# EAGLE design RGBNDR (EAGLE 9.0.0)
CNAME: otsos.net; CREVISION: 3; DESIGNER: Otso Sorvettula
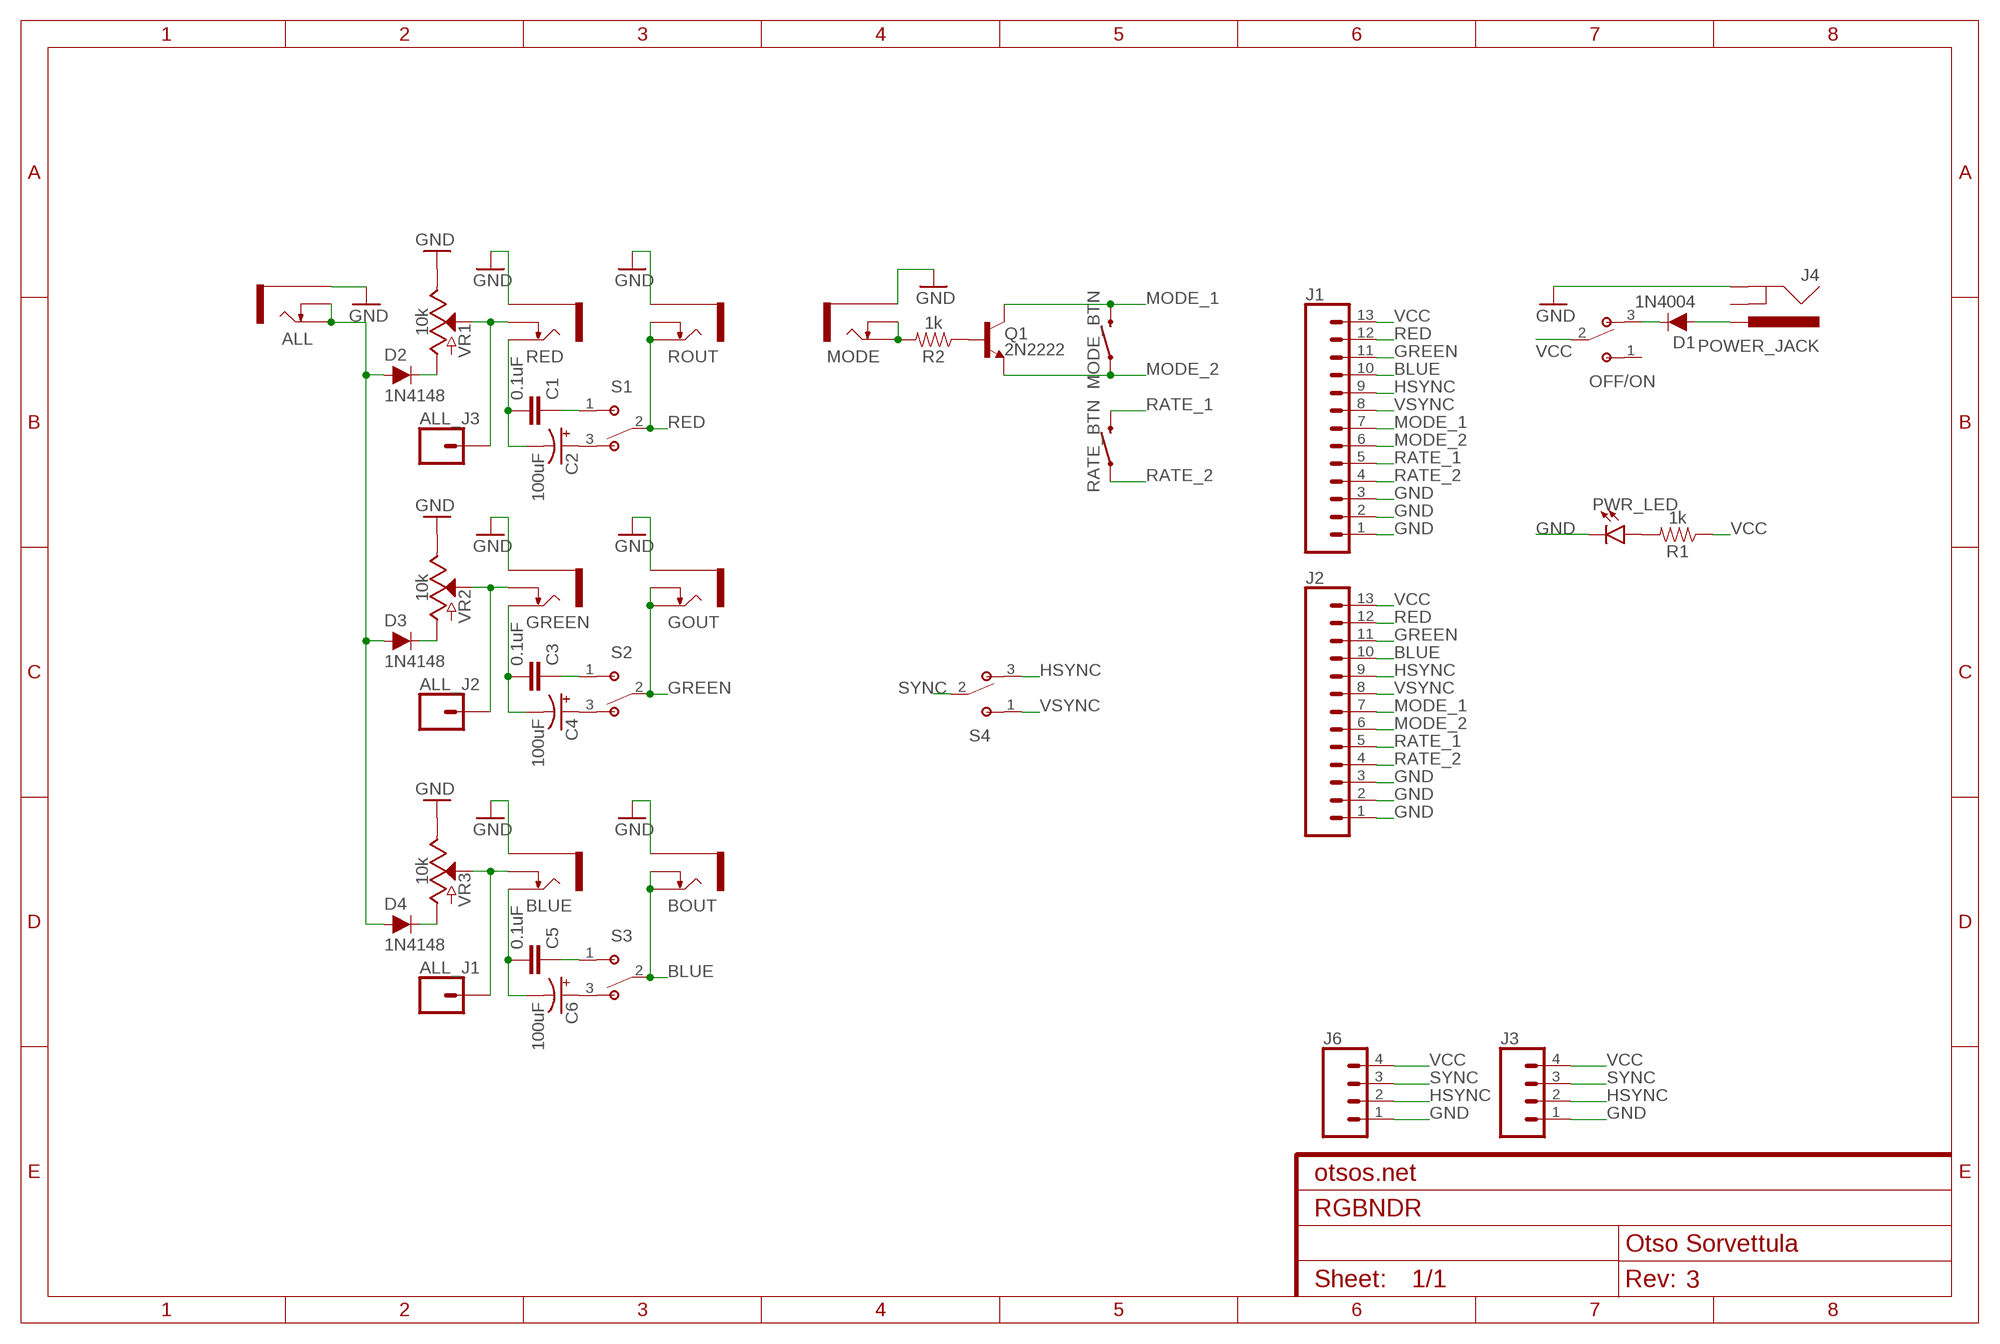
[diagram p0: schematic, sheet 1]

## Parts
ALL  THONKICONNNEW  [WQP-PJ301M-12_JACK]
ALL_J1  CONN_01PTH_NO_SILK_YES_STOP  [1X01_NO_SILK]
ALL_J2  CONN_01PTH_NO_SILK_YES_STOP  [1X01_NO_SILK]
ALL_J3  CONN_01PTH_NO_SILK_YES_STOP  [1X01_NO_SILK]
BLUE  THONKICONNNEW  [WQP-PJ301M-12_JACK]
BOUT  THONKICONNNEW  [WQP-PJ301M-12_JACK]
C1  0.1uF  C-EU025-025X050  [C025-025X050]
C2  100uF  100UF-POLAR-RADIAL-2.5MM-25V-20%  [CPOL-RADIAL-2.5MM-6.5MM]
C3  0.1uF  C-EU025-025X050  [C025-025X050]
C4  100uF  100UF-POLAR-RADIAL-2.5MM-25V-20%  [CPOL-RADIAL-2.5MM-6.5MM]
C5  0.1uF  C-EU025-025X050  [C025-025X050]
C6  100uF  100UF-POLAR-RADIAL-2.5MM-25V-20%  [CPOL-RADIAL-2.5MM-6.5MM]
D1  1N4004  DIODE-PTH  [DIODE-1N4001]
D2  1N4148  DIODE-1N4148  [DIODE-1N4148]
D3  1N4148  DIODE-1N4148  [DIODE-1N4148]
D4  1N4148  DIODE-1N4148  [DIODE-1N4148]
GOUT  THONKICONNNEW  [WQP-PJ301M-12_JACK]
GREEN  THONKICONNNEW  [WQP-PJ301M-12_JACK]
J1  CONN_13LONGPADS  [1X13-LONGPADS]
J2  CONN_13LONGPADS  [1X13-LONGPADS]
J3  CONN_04  [1X04]
J4  POWER_JACK  [POWER_JACK_PTH]
J6  CONN_04  [1X04]
MODE  THONKICONNNEW  [WQP-PJ301M-12_JACK]
MODE_BTN  MOMENTARY-SWITCH-SPST-PTH-6.0MM  [TACTILE_SWITCH_PTH_6.0MM]
OFF/ON  OS102011MS2QN1  [SW_OS102011MS2QN1]
PWR_LED  LED3MM  [LED_3MM]
Q1  2N2222  TRANS_NPN-2N3904  [TO-92]
R1  1k  1KOHM-HORIZ-1/4W-1%  [AXIAL-0.3]
R2  1k  1KOHM-HORIZ-1/4W-1%  [AXIAL-0.3]
RATE_BTN  MOMENTARY-SWITCH-SPST-PTH-6.0MM  [TACTILE_SWITCH_PTH_6.0MM]
RED  THONKICONNNEW  [WQP-PJ301M-12_JACK]
ROUT  THONKICONNNEW  [WQP-PJ301M-12_JACK]
S1  OS102011MS2QN1  [SW_OS102011MS2QN1]
S2  OS102011MS2QN1  [SW_OS102011MS2QN1]
S3  OS102011MS2QN1  [SW_OS102011MS2QN1]
S4  OS102011MS2QN1  [SW_OS102011MS2QN1]
VR1  10k  POTENTIOMETER-PTH-9MM-1/20W-20%  [POT-PTH-ALPS]
VR2  10k  POTENTIOMETER-PTH-9MM-1/20W-20%  [POT-PTH-ALPS]
VR3  10k  POTENTIOMETER-PTH-9MM-1/20W-20%  [POT-PTH-ALPS]

## Nets
BLUE: BOUT.P$1_TIP(TIP) BOUT.P$2_SWITCH(SWITCH) J1.10 J2.10 S3.2
GND: ALL.P$3_SLEEVE(SLEEVE) BLUE.P$3_SLEEVE(SLEEVE) BOUT.P$3_SLEEVE(SLEEVE) GOUT.P$3_SLEEVE(SLEEVE) GREEN.P$3_SLEEVE(SLEEVE) J1.1 J1.2 J1.3 J2.1 J2.2 J2.3 J3.1 J4.GND J6.1 MODE.P$3_SLEEVE(SLEEVE) PWR_LED.K(C) RED.P$3_SLEEVE(SLEEVE) ROUT.P$3_SLEEVE(SLEEVE) VR1.P$1(E) VR2.P$1(E) VR3.P$1(E)
GREEN: GOUT.P$1_TIP(TIP) GOUT.P$2_SWITCH(SWITCH) J1.11 J2.11 S2.2
HSYNC: J1.9 J2.9 J3.2 J6.2 S4.3
MODE_1: J1.7 J2.7 MODE_BTN.3 Q1.3(C)
MODE_2: J1.6 J2.6 MODE_BTN.1 Q1.1(E)
N$1: ALL_J3.1 RED.P$2_SWITCH(SWITCH) VR1.P$2(S)
N$2: ALL_J2.1 GREEN.P$2_SWITCH(SWITCH) VR2.P$2(S)
N$3: ALL_J1.1 BLUE.P$2_SWITCH(SWITCH) VR3.P$2(S)
N$4: D1.A J4.PWR
N$5: D1.C OFF/ON.3
N$6: D2.C VR1.P$3(A)
N$7: D3.C VR2.P$3(A)
N$8: D4.C VR3.P$3(A)
N$9: PWR_LED.A R1.P$2
N$49: MODE.P$1_TIP(TIP) MODE.P$2_SWITCH(SWITCH) R2.P$2
N$51: C1.1 S1.1
N$52: C2.1(+) S1.3
N$53: C1.2 C2.2(-) RED.P$1_TIP(TIP)
N$55: Q1.2(B) R2.P$1
N$57: C3.1 S2.1
N$58: C4.1(+) S2.3
N$59: C3.2 C4.2(-) GREEN.P$1_TIP(TIP)
N$60: ALL.P$1_TIP(TIP) ALL.P$2_SWITCH(SWITCH) D2.A D3.A D4.A
N$62: C5.1 S3.1
N$63: C6.1(+) S3.3
N$64: BLUE.P$1_TIP(TIP) C5.2 C6.2(-)
RATE_1: J1.5 J2.5 RATE_BTN.3
RATE_2: J1.4 J2.4 RATE_BTN.1
RED: J1.12 J2.12 ROUT.P$1_TIP(TIP) ROUT.P$2_SWITCH(SWITCH) S1.2
SYNC: J3.3 J6.3 S4.2
VCC [VCC]: J1.13 J2.13 J3.4 J6.4 OFF/ON.2 R1.P$1
VSYNC: J1.8 J2.8 S4.1
Unconnected: J4.GNDBREAK OFF/ON.1

## Library data of the parts
ALL BLUE BOUT GOUT GREEN MODE RED ROUT = MusicThingModular:THONKICONN: 3.5mm socket for Eurorack modular synths
ALL_J1-ALL_J3 = SparkFun-Connectors:CONN_01: Single connection point. Often used as Generic Header-pin footprint for 0.1 inch spaced/style header connections On any of the 0.1 inch spaced packages, you can populate with these: Break Away Headers - Straight <https://www.sparkfun.com/products/116> (PRT-00116) Break Away Male Headers - Right Angle <https://www.sparkfun.com/products/553> (PRT-00553) Female Headers <https://www.sparkfun.com/products/115> (PRT-00115) Break Away Headers - Machine Pin <https://www.sparkfun.com/products/117> (PRT-00117) Break Away Female Headers - Swiss Machine Pin <https://www.sparkfun.com/products/743> (PRT-00743) This device is also useful as a general connection point to wire up your design to another part of your project. Our various solder wires solder well into these plated through hole pads. Hook-Up Wire - Assortment (Stranded, 22 AWG) <https://www.sparkfun.com/products/11375> (PRT-11375) Hook-Up Wire - Assortment (Solid Core, 22 AWG) <https://www.sparkfun.com/products/11367> (PRT-11367) View the entire wire category on our website here <https://www.sparkfun.com/categories/141> Special notes: SMTSO-256-ET is a "flush mount" nut for a 4-40 screw. We mostly use this on specialty testbeds; it is a nice way to connect hardware to your PCB at an adjustable hieght. Also note, the SNAP packages are for using a snappable style connector. We sell a baggie of snaps and they are also used on two LilyPad designs: Snap Assortment - 30 pack (male and female) <https://www.sparkfun.com/products/11347> (DEV-11347) LilyPad Arduino SimpleSnap <https://www.sparkfun.com/products/10941> (DEV-10941) LilyPad SimpleSnap Protoboard <https://www.sparkfun.com/products/10940> (DEV-10940)
C1 C3 C5 = rcl:C-EU: CAPACITOR, European symbol; SPICEPREFIX: C
C2 C4 C6 = SparkFun-Capacitors:100UF-POLAR: 100µF polarized capacitors A capacitor is a passive two-terminal electrical component used to store electrical energy temporarily in an electric field.; PROD_ID: CAP-08439
D1 = SparkFun-DiscreteSemi:DIODE: Diode These are standard reverse protection diodes and small signal diodes. SparkFun Products: SparkFun SparkPunk Sound Kit <https://www.sparkfun.com/products/11177> SparkFun ESP8266 Thing <https://www.sparkfun.com/products/13231>; PROD_ID: DIO-09176; VALUE: 1A/50V/1.1V
D2-D4 = SparkFun-DiscreteSemi:DIODE: Diode These are standard reverse protection diodes and small signal diodes. SparkFun Products: SparkFun SparkPunk Sound Kit <https://www.sparkfun.com/products/11177> SparkFun ESP8266 Thing <https://www.sparkfun.com/products/13231>; PROD_ID: DIO-08378; VALUE: 200mA/100V/1V
J1 J2 = SparkFun-Connectors:CONN_13: Multi connection point. Often used as Generic Header-pin footprint for 0.1 inch spaced/style header connections On any of the 0.1 inch spaced packages, you can populate with these: Break Away Headers - Straight <https://www.sparkfun.com/products/116> (PRT-00116) Break Away Male Headers - Right Angle <https://www.sparkfun.com/products/553> (PRT-00553) Female Headers <https://www.sparkfun.com/products/115> (PRT-00115) Break Away Headers - Machine Pin <https://www.sparkfun.com/products/117> (PRT-00117) Break Away Female Headers - Swiss Machine Pin <https://www.sparkfun.com/products/743> (PRT-00743) For SCREWTERMINALS and SPRING TERMINALS visit here: Screw Terimnals on SparkFun.com <https://www.sparkfun.com/search/results?term=Screw+Terminals> (5mm/3.5mm/2.54mm spacing) This device is also useful as a general connection point to wire up your design to another part of your project. Our various solder wires solder well into these plated through hole pads. Hook-Up Wire - Assortment (Stranded, 22 AWG) <https://www.sparkfun.com/products/11375> (PRT-11375) Hook-Up Wire - Assortment (Solid Core, 22 AWG) <https://www.sparkfun.com/products/11367> (PRT-11367) View the entire wire category on our website here <https://www.sparkfun.com/categories/141> Special notes: Molex polarized connector foot print use with SKU : PRT-08231 with associated crimp pins and housings. 1MM SMD Version SKU: PRT-10208 NOTES ON THE VARIANTS LOCK and LOCK_LONGPADS... This footprint was designed to help hold the alignment of a through-hole component (i.e. 6-pin header) while soldering it into place. You may notice that each hole has been shifted either up or down by 0.005 of an inch from it's more standard position (which is a perfectly straight line). This slight alteration caused the pins (the squares in the middle) to touch the edges of the holes. Because they are alternating, it causes a "brace" to hold the component in place. 0.005 has proven to be the perfect amount of "off-center" position when using our standard breakaway headers. Although looks a little odd when you look at the bare footprint, once you have a header in there, the alteration is very hard to notice. Also,if you push a header all the way into place, it is covered up entirely on the bottom side.
J3 J6 = SparkFun-Connectors:CONN_04: Multi connection point. Often used as Generic Header-pin footprint for 0.1 inch spaced/style header connections On any of the 0.1 inch spaced packages, you can populate with these: Break Away Headers - Straight <https://www.sparkfun.com/products/116> (PRT-00116) Break Away Male Headers - Right Angle <https://www.sparkfun.com/products/553> (PRT-00553) Female Headers <https://www.sparkfun.com/products/115> (PRT-00115) Break Away Headers - Machine Pin <https://www.sparkfun.com/products/117> (PRT-00117) Break Away Female Headers - Swiss Machine Pin <https://www.sparkfun.com/products/743> (PRT-00743) For SCREWTERMINALS and SPRING TERMINALS visit here: Screw Terimnals on SparkFun.com <https://www.sparkfun.com/search/results?term=Screw+Terminals> (5mm/3.5mm/2.54mm spacing) This device is also useful as a general connection point to wire up your design to another part of your project. Our various solder wires solder well into these plated through hole pads. Hook-Up Wire - Assortment (Stranded, 22 AWG) <https://www.sparkfun.com/products/11375> (PRT-11375) Hook-Up Wire - Assortment (Solid Core, 22 AWG) <https://www.sparkfun.com/products/11367> (PRT-11367) View the entire wire category on our website here <https://www.sparkfun.com/categories/141> Special notes: Molex polarized connector foot print use with SKU : PRT-08231 with associated crimp pins and housings. 1MM SMD Version SKU: PRT-10208; PROD_ID: CONN-09696
J4 = SparkFun-Connectors:POWER_JACK: Power Jack Connector This is the standard 5.5mm barrel jack for power. The PTH is the most common, proven, reliable, footprint. The Slot footprint only works if the mill layer is transmitted to the PCB fab house so be warned. Here are the connectors we sell at SparkFun: DC Barrel Power Jack/Connector <https://www.sparkfun.com/products/119> (PRT-00119) DC Barrel Power Jack/Connector (SMD) <https://www.sparkfun.com/products/12748> (PRT-12748) DC Barrel Jack Adapter - Breadboard Compatible <https://www.sparkfun.com/products/10811> (PRT-10811) It is used on this SparkFun product (and many, many others): SparkFun RedBoard - Programmed with Arduino <https://www.sparkfun.com/products/12757> (DEV-12757) Also, if you need a mating power supply or connector, please check these out: Wall Adapter Power Supply - 9VDC 650mA <https://www.sparkfun.com/products/298> (TOL-00298) DC Barrel Jack Adapter - Male <https://www.sparkfun.com/products/10287> (PRT-10287); PROD_ID: CONN-08197
MODE_BTN RATE_BTN = SparkFun-Switches:MOMENTARY-SWITCH-SPST: Momentary Switch (Pushbutton) - SPST Normally-open (NO) SPST momentary switches (buttons, pushbuttons). Variants PTH-12MM - 12mm square, through-hole Momentary Pushbutton Switch - 12mm Square <https://www.sparkfun.com/products/9190> (COM-09190) PTH-6.0MM, PTH-6.0MM-KIT - 6.0mm square, through-hole Mini Pushbutton Switch <https://www.sparkfun.com/products/97> (COM-00097) KIT package intended for soldering kit's - only one side of pads' copper is exposed. PTH-RIGHT-ANGLE-KIT - Right-angle, through-hole Right Angle Tactile Button <https://www.sparkfun.com/products/10791> - Used on SparkFun BigTime Watch Kit <https://www.sparkfun.com/products/11734> SMD-12MM - 12mm square, surface-mount Tactile Button - SMD (12mm) <https://www.sparkfun.com/products/12993> (COM-12993) Used on SparkFun PicoBoard <https://www.sparkfun.com/products/11888> SMD-4.5MM - 4.5mm Square Trackball Switch Used on SparkFun Blackberry Trackballer Breakout <https://www.sparkfun.com/products/13169> SMD-4.6MMX2.8MM - 4.60mm x 2.80mm, surface mount Used on SparkFun SAMD21 Mini Breakout <https://www.sparkfun.com/products/13664> SMD-5.2MM, SMD-5.2-REDUNDANT - 5.2mm square, surface-mount Mini Pushbutton Switch - SMD <https://www.sparkfun.com/products/8720> (COM-08720) Used on Arduino Pro Mini <https://www.sparkfun.com/products/11114> REDUNDANT package connects both switch circuits together SMD-6.0X3.5MM - 6.0 x 3.5mm, surface mount Momentary Reset Switch SMD <https://www.sparkfun.com/products/8229> (COM-08229) SMD-6.2MM-TALL - 6.2mm square, surface mount Tactile Button - SMD (6mm) <https://www.sparkfun.com/products/12992> Used on SparkFun Digital Sandbox <https://www.sparkfun.com/products/12651> SMD-RIGHT-ANGLE - Right-angle, surface mount Used on SparkFun Block for Intel® Edison - Arduino <https://www.sparkfun.com/products/13036>; PROD_ID: SWCH-08441; SF_SKU: COM-00097
OFF/ON S1-S4 = OS102011MS2QN1:OS102011MS2QN1: Switch Slide ON ON SPDT Top Slide 0.1A 12VDC 10000Cycles PC Pins Thru-Hole Bulk; AVAILABILITY: Unavailable; DESCRIPTION: Switch Slide ON ON SPDT Top Slide 0.1A 12VDC 10000Cycles PC Pins Thru-Hole Bulk; MF: C&K; MP: OS102011MS2QN1; PACKAGE: DO-201 C&amp;K Components; PRICE: None
PWR_LED = SparkFun-LED:LED: LED (Generic) Standard schematic elements and footprints for 5mm, 3mm, 1206, and 0603 sized LEDs. Generic LEDs with no color specified.; PROD_ID: DIO-08794
Q1 = SparkFun-DiscreteSemi:TRANS_NPN: NPN transistor Current controlled devices typically used to amplify current or used as a switch. BC547 - COM-08928 <http://www.sparkfun.com/products/8928> (TO-92 45V 100mA) (1.Collector 2.Base 3.Emitter) 2N3904 - COM-00521 <http://www.sparkfun.com/products/521> (TO-92 40V 200mA) (1.Emitter 2.Base 3.Collector) P2N2222A - COM-12852 <http://www.sparkfun.com/products/12852> (TO-92 40V 600mA) (1.Collector 2.Base 3.Emitter); PROD_ID: TRANS-08447; VALUE: 200mA/40V
R1 R2 = SparkFun-Resistors:1KOHM: 1kΩ resistor A resistor is a passive two-terminal electrical component that implements electrical resistance as a circuit element. Resistors act to reduce current flow, and, at the same time, act to lower voltage levels within circuits. - Wikipedia; PROD_ID: RES-12182
VR1-VR3 = SparkFun-Resistors:POTENTIOMETER: Potentiometer (Pot) Three-terminal potentiometers, with an adjustable wiper and two adjustable resistors. A pot can be used to create a configurable voltage divider, or as a variable resistor. Variants ALPS_POT and ALPS_POT_KIT - PTH, breadboard compatible, 9mm square pots Rotary Potentiometer - Linear (10k ohm) <https://www.sparkfun.com/products/9288> (COM-09288) The KIT variant exposes copper on only one side of the PTH pad, so the part can only be assembled on one side of the PCB. Useful for beginner soldering kits.; PROD_ID: RES-09177; SF_SKU: COM-09288

## Net classes
0 default: width 0.254 mm, clearance 0.254 mm
1 VCC: width 0.508 mm, clearance 0.508 mm
2 GND: width 0.508 mm, clearance 0.508 mm

## Board
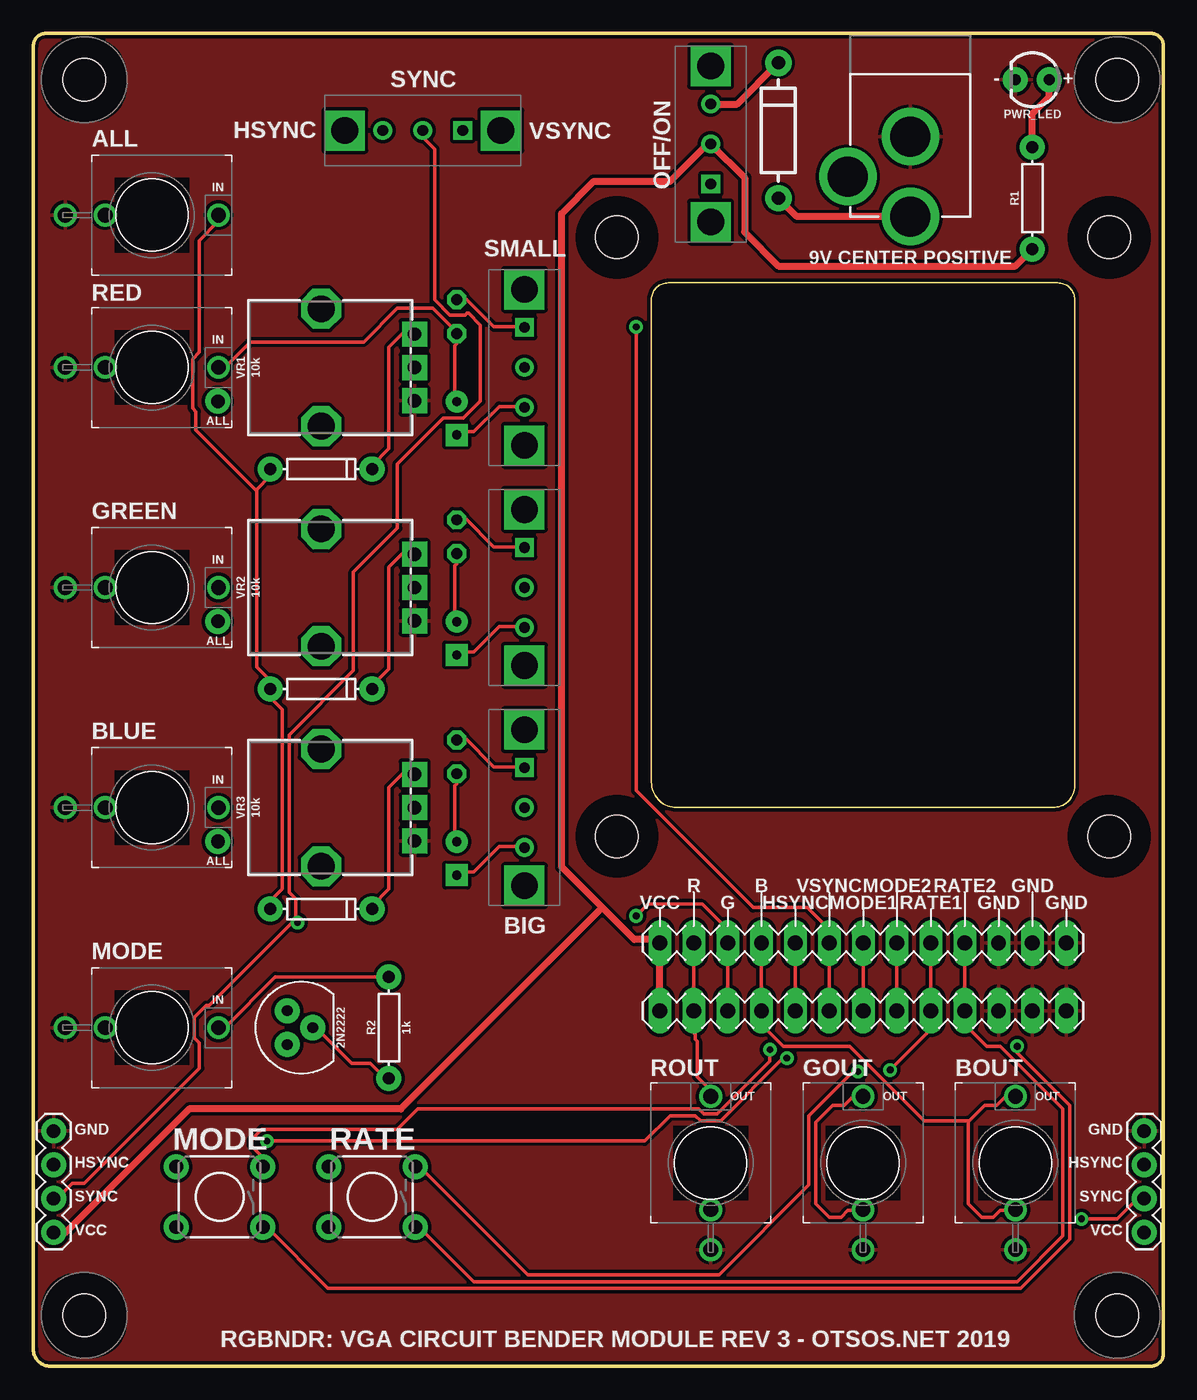
[diagram p1: board, top side]
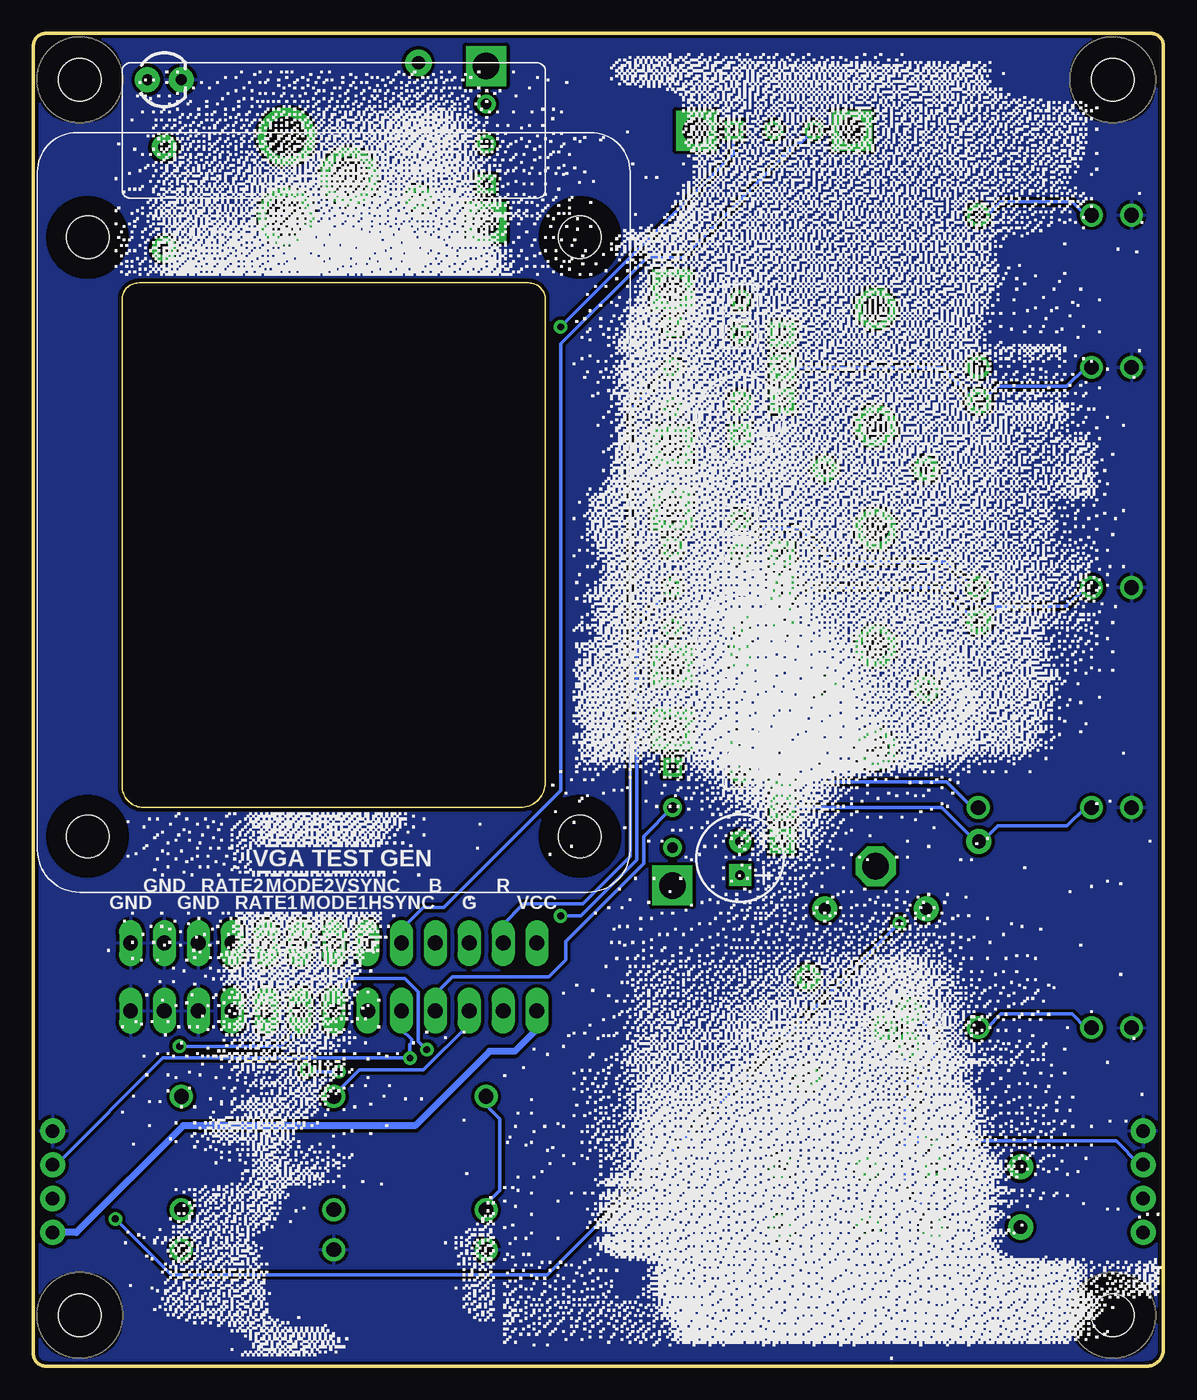
[diagram p2: board, bottom side, seen from below]

Size 84.76 x 100 mm. Coordinates in mm from the lower left corner, seen from the top.
Outline: 0,1.27 0,99.06 arc-90 0.94,100 83.82,100 arc-90 84.76,99.06 84.76,0.94 arc-90 83.82,0 1.27,0 arc-90 0,1.27
Copper layers (1*16): Top 0.035mm / dielectric 1.5mm / Bottom 0.035mm
Design rules "SparkFun": minimum track width 8mil, minimum drill 20mil, track to track 8mil, track to pad 8mil, pad to pad 8mil, via to via 8mil, smd to smd 8mil, copper to edge 10mil, drill to drill 8mil, minimum pad ring 12mil, minimum via ring 10mil, stop-mask expansion 4mil, vias tented up to drill 25mil, thermal gap 10mil

### Footprints (pad centres in the part's own frame; a part is rotated, then mirrored left to right if it is on the bottom)
WQP-PJ301M-12_JACK = drill 1.1: P$1_TIP 0,5; P$2_SWITCH 0,-3.5; P$3_SLEEVE 0,-6.5
1X01_NO_SILK = drill 1.016 pad 1.88: 1 0,0
C025-025X050 = drill 0.813 octagon: 1 -1.27,0; 2 1.27,0
CPOL-RADIAL-2.5MM-6.5MM = drill 0.7 pad 1.651 square: 1 1.25,0 | drill 0.7 pad 1.651: 2 -1.25,0
DIODE-1N4001 = drill 1 pad 1.981: A -5.08,0; C 5.08,0
DIODE-1N4148 = drill 0.9 pad 1.88: A -3.81,0; C 3.81,0
1X13-LONGPADS = drill 1.118 long: 1 0,0; 2 2.54,0; 3 5.08,0; 4 7.62,0; 5 10.16,0; 6 12.7,0; 7 15.24,0; 8 17.78,0; 9 20.32,0; 10 22.86,0; 11 25.4,0; 12 27.94,0; 13 30.48,0
1X04 = drill 1.016 pad 1.88: 1 0,0; 2 2.54,0; 3 5.08,0; 4 7.62,0
POWER_JACK_PTH = drill 2.997 pad 4.318: GND 0,7.7; GNDBREAK 4.7,10.7; PWR 0,13.7
TACTILE_SWITCH_PTH_6.0MM = drill 1.016 pad 1.88: 1 -3.251,2.261; 2 3.251,2.261; 3 -3.251,-2.261; 4 3.251,-2.261
SW_OS102011MS2QN1 = drill 0.8 square: 1 -3,0 | drill 0.8: 2 0,0; 3 3,0 | drill 2 pad 2.54 square: P$1 5.85,0; P$2 -5.85,0
LED_3MM = drill 0.813 pad 1.88: A -1.27,0; K 1.27,0
TO-92 = drill 0.813 pad 1.88: 1 -1.27,0; 2 0,1.905; 3 1.27,0
AXIAL-0.3 = drill 0.9 pad 1.88: P$1 -3.81,0; P$2 3.81,0
VGATESTGEN = hole 3.2: -18.46,-22.47; 18.46,-22.47; -18.46,22.47; 18.46,22.47
MOUNTING_HOLE = hole 3.2: 0,0
POT-PTH-ALPS = drill 1 pad 1.88 square: P$1 7,-2.5; P$2 7,0; P$3 7,2.5 | drill 2 octagon: P$4 0,-4.4; P$5 0,4.4

### Placement (x,y rotation side)
ALL  8.89,86.36 270 top
ALL_J1  13.84,39.37 0 top
ALL_J2  13.84,55.88 180 top
ALL_J3  13.84,72.39 180 top
BLUE  8.89,41.91 270 top
BOUT  73.66,15.24 0 top
C1  31.75,78.74 270 bottom
C2  31.75,71.12 270 bottom
C3  31.75,62.23 270 bottom
C4  31.75,54.61 270 bottom
C5  31.75,45.72 270 bottom
C6  31.75,38.1 270 bottom
D1  55.88,92.71 90 top
D2  21.59,67.31 0 top
D3  21.59,50.8 0 top
D4  21.59,34.29 0 top
GOUT  62.23,15.24 0 top
GREEN  8.89,58.42 270 top
J1  77.47,26.67 180 top
J2  77.47,31.75 180 top
J3  83.31,17.65 270 top
J4  65.79,99.95 180 top
J6  1.52,17.65 270 top
MODE  8.89,25.4 270 top
MODE_BTN  13.97,12.7 180 top
OFF/ON  50.8,91.69 90 top
PWR_LED  74.93,96.52 180 top
Q1  19.05,25.4 90 bottom
R1  74.93,87.63 90 top
R2  26.67,25.4 90 top
RATE_BTN  25.4,12.7 180 top
RED  8.89,74.93 270 top
ROUT  50.8,15.24 0 top
S1  36.83,74.93 270 top
S2  36.83,58.42 270 top
S3  36.83,41.91 270 top
S4  29.21,92.71 180 top
U$1  [VGATESTGEN]  62.23,62.23 0 bottom
U$2  [MOUNTING_HOLE]  81.28,96.52 0 top
U$3  [MOUNTING_HOLE]  3.81,96.52 0 top
U$4  [MOUNTING_HOLE]  81.28,3.81 0 top
U$5  [MOUNTING_HOLE]  3.81,3.81 0 top
VR1  21.59,74.93 0 top
VR2  21.59,58.42 0 top
VR3  21.59,41.91 0 top

### Tracks (layer width: path | path; a pad name or v marks a point on that pad's centre or on a via)
BLUE
  Top 0.254: 70.17,18.35 71.37,19.56 72.26,19.56 72.9,20.19 73.66,20.19 BOUT.P$1_TIP | 70.17,18.35 70.1,18.29 70.1,12.19 71.12,11.18 72.01,11.18 72.52,11.68 73.66,11.68 BOUT.P$2_SWITCH | 70.17,18.35 70.1,18.41 66.8,18.41 61.21,24 56.26,24 54.61,25.65 J1.10 J2.10
  Bottom 0.254: S3.2 38.99,39.75 38.99,37.72 44.83,31.88 44.83,30.48 46.1,29.21 53.34,29.21 54.61,27.94 J1.10 | J2.10 54.61,30.73
GND
  Top 0.254: 72.39,27.94 J1.3
  pour Bottom: 0,100.33 0,0 85.09,0 85.09,100.33
  pour Top: 0,100.33 0,0 85.09,0 85.09,100.33
GREEN  (via drill 0.51)
  Top 0.254: GOUT.P$2_SWITCH 62.23,11.68 61.09,11.68 60.58,11.18 59.69,11.18 58.67,12.19 58.67,18.29 59.94,19.56 60.83,19.56 61.47,20.19 62.23,20.19 GOUT.P$1_TIP | v45.21,33.78 46.1,34.67 50.16,34.67 52.07,32.77 J2.11 | 52.07,27.94 J1.11 J2.11 | J2.11 52.07,30.35
  Bottom 0.254: S2.2 39.5,55.75 39.5,37.97 43.69,33.78 v45.21,33.78 | J1.11 52.07,25.65 55.5,22.23 60.33,22.23 62.23,20.32 GOUT.P$1_TIP
HSYNC  (via drill 0.51)
  Top 0.254: 57.15,27.94 J1.9 J2.9 57.15,30.35 | v17.53,16.89 45.85,16.89 47.75,18.8 49.66,18.8 50.04,18.41 51.56,18.41 56.26,23.11 v56.52,23.11
  Bottom 0.254: J2.9 57.15,32.77 55.5,34.42 53.98,34.42 45.21,43.18 45.21,76.71 38.73,83.19 36.07,83.19 27.43,91.82 27.18,91.82 26.29,92.71 S4.3 | J6.2 1.78,15.11 3.56,16.89 v17.53,16.89 | J1.9 57.15,25.27 56.39,24.51 56.39,24.26 56.52,24.13 v56.52,23.11 75.06,23.11 83.06,15.11 J3.2
MODE_1  (via drill 0.51)
  Top 0.254: 62.23,27.94 J1.7 J2.7 62.23,30.35 | v55.24,23.75 55.24,22.86 51.31,18.92 50.29,18.92 49.91,19.3 28.83,19.3 27.3,17.78 17.14,17.78 16.38,17.02 16.38,16.51 17.14,15.75 17.14,14.99 MODE_BTN.3
  Bottom 0.254: Q1.3 18.8,26.67 17.14,25.02 17.14,23.37 18.41,22.1 18.41,16.38 17.27,15.24 17.27,14.99 MODE_BTN.3 | J1.7 62.23,27.94 61.09,29.08 57.66,29.08 57.15,29.08 56.9,29.08 55.88,28.07 55.88,24.38 v55.24,23.75
MODE_2  (via drill 0.51)
  Top 0.254: 64.77,27.94 J1.6 J2.6 64.77,30.35 | v73.79,24 73.79,23.5 77.72,19.56 77.72,9.53 74.04,5.84 22.1,5.84 17.53,10.41 17.27,10.41 MODE_BTN.1
  Bottom 0.254: Q1.1 19.05,23.5 19.43,23.11 19.43,13.34 18.03,11.94 18.03,11.68 17.27,10.92 17.27,10.54 MODE_BTN.1 | J1.6 64.77,25.4 66.17,24 v73.79,24
N$1
  Bottom 0.254: RED.P$2_SWITCH 5.84,74.93 7.24,73.53 12.45,73.53 13.59,72.39 ALL_J3.1 14.1,72.39 16.64,74.93 VR1.P$2
N$2
  Bottom 0.254: GREEN.P$2_SWITCH 5.84,58.42 7.24,57.02 12.45,57.02 13.59,55.88 ALL_J2.1 14.1,55.88 16.64,58.42 VR2.P$2
N$3
  Bottom 0.254: BLUE.P$2_SWITCH 5.84,41.91 7.24,40.51 12.45,40.51 13.59,39.37 ALL_J1.1 14.1,39.37 16.64,41.91 VR3.P$2
N$4
  Top 0.508: J4.PWR 57.26,86.25 D1.A
N$5
  Top 0.254: 50.8,94.61 OFF/ON.3
  Top 0.508: OFF/ON.3 52.78,94.69 D1.C
N$6
  Top 0.254: D2.C 25.4,67.56 26.67,68.83 26.67,76.45 27.69,77.47 28.57,77.47 VR1.P$3
N$7
  Top 0.254: D3.C 25.4,51.05 26.67,52.32 26.67,59.94 27.69,60.96 28.57,60.96 VR2.P$3
N$8
  Top 0.254: D4.C 25.4,34.54 26.67,35.81 26.67,43.43 27.69,44.45 28.57,44.45 VR3.P$3
N$9
  Top 0.508: R1.P$2 74.93,93.98 76.2,95.25 PWR_LED.A
N$49
  Top 0.254: R2.P$2 18.16,29.21 14.35,25.4 MODE.P$1_TIP
  Bottom 0.254: MODE.P$2_SWITCH 5.84,25.4 6.86,26.42 12.19,26.42 13.21,25.4 MODE.P$1_TIP
N$51
  Top 0.254: C1.1 31.88,80.14 32.38,80.14 34.54,77.98 36.83,77.98 S1.1
N$52
  Top 0.254: S1.3 36.83,72.01 34.92,72.01 33.02,70.1 31.88,70.1 31.75,69.98 C2.1
N$53
  Top 0.254: C2.2 31.75,72.39 31.62,72.52 31.62,76.58 31.75,76.71 C1.2 31.75,77.6 29.97,79.38 27.3,79.38 24.77,76.83 16.26,76.83 14.35,74.93 RED.P$1_TIP
N$55
  Top 0.254: Q1.2 21.21,25.4 23.88,22.73 25.27,22.73 26.42,21.59 R2.P$1
N$57
  Top 0.254: C3.1 31.88,63.63 32.38,63.63 34.54,61.47 36.83,61.47 S2.1
N$58
  Top 0.254: S2.3 36.83,55.5 34.92,55.5 33.02,53.59 31.88,53.59 31.75,53.47 C4.1
N$59
  Top 0.254: C3.2 31.75,60.2 31.62,60.07 31.62,56.01 31.75,55.88 C4.2
  Bottom 0.254: GREEN.P$1_TIP 14.35,58.42 16.26,60.33 24.77,60.33 27.3,62.87 29.97,62.87 31.75,61.09 C3.2
N$60
  Top 0.254: D4.A 17.78,34.92 18.67,35.81 18.67,49.28 17.78,50.16 D3.A 17.78,51.44 16.76,52.45 16.76,65.66 | D2.A 17.78,66.8 16.76,65.79 16.76,65.66 | 16.76,65.66 12.19,70.23 12.19,71.63 11.94,71.88 11.94,75.56 12.45,76.07 12.45,84.45 13.84,85.85 13.84,86.36 ALL.P$1_TIP
  Bottom 0.254: ALL.P$2_SWITCH 5.84,86.36 6.86,87.38 12.19,87.38 13.21,86.36 ALL.P$1_TIP
N$62
  Top 0.254: C5.1 31.88,47.12 32.38,47.12 34.54,44.96 36.83,44.96 S3.1
N$63
  Top 0.254: S3.3 36.83,38.99 34.92,38.99 33.02,37.08 31.88,37.08 31.75,36.96 C6.1
N$64
  Top 0.254: C5.2 31.75,43.69 31.62,43.56 31.62,39.5 31.75,39.37 C6.2
  Bottom 0.254: BLUE.P$1_TIP 14.35,41.91 16.26,43.81 24.77,43.81 27.3,46.35 29.97,46.35 31.75,44.58 C5.2
RATE_1  (via drill 0.51)
  Top 0.254: 67.31,27.94 J1.5 | 67.31,30.35 J2.5 J1.5 | v61.85,22.1 61.47,22.1 58.17,18.8 58.17,13.59 51.44,6.86 37.08,6.86 29.08,14.86 28.7,14.86 RATE_BTN.3 | v64.26,22.23 67.31,25.27 J1.5
  Bottom 0.254: v61.85,22.1 64.14,22.1 v64.26,22.23
RATE_2
  Top 0.254: 69.85,27.94 J1.4 | 69.85,30.35 J2.4 J1.4 | J1.4 69.85,25.65 71.5,24 72.52,24 77.22,19.3 77.22,9.78 73.79,6.35 33.02,6.35 28.96,10.41 28.7,10.41 RATE_BTN.1
RED
  Top 0.254: 49.53,27.94 J1.12 | 49.53,30.35 J2.12 J1.12 | ROUT.P$1_TIP 50.8,20.7 49.78,21.72 49.78,24.38 49.66,24.51 49.66,24.89 49.53,25.02 J1.12
  Bottom 0.254: ROUT.P$2_SWITCH 50.8,12.19 49.78,13.21 49.78,18.54 50.8,19.56 ROUT.P$1_TIP | S1.2 40.01,71.75 40.01,38.23 43.56,34.67 48.01,34.67 49.53,33.15 J2.12
SYNC  (via drill 0.51)
  Top 0.254: S4.2 29.21,92.2 30.1,91.31 30.1,80.01 31.24,78.87 32.38,78.87 32.51,78.99 32.64,78.99 33.53,78.11 33.53,72.39 32.26,71.12 30.73,71.12 27.3,67.69 27.3,62.87 24,59.56 24,52.2 19.18,47.37 19.18,35.56 19.68,35.05 19.68,33.53 19.62,33.47 | 19.62,33.47 13.21,27.05 12.95,27.05 12.06,26.16 12.06,24.64 12.45,24.26 12.45,22.35 3.81,13.72 2.92,13.72 1.78,12.57 J6.3 | J3.3 82.8,12.57 81.28,11.05 v78.61,11.05 | 19.62,33.47 v19.81,33.27
  Bottom 0.254: v78.61,11.05 74.42,6.86 46.23,6.86 v19.81,33.27
VCC
  Top 0.508: 42.67,34.42 45.09,32 46.74,32 J2.13 J1.13 | 42.67,34.42 39.62,37.47 39.62,86.49 42.04,88.9 47.75,88.9 50.55,91.69 OFF/ON.2 53.34,89.15 53.34,85.09 55.88,82.55 73.66,82.55 R1.P$1 | J6.4 2.41,10.03 11.68,19.3 27.56,19.3 42.67,34.42
  Bottom 0.508: J3.4 81.53,10.03 73.53,18.03 56.13,18.03 50.55,23.62 48.64,23.62 46.99,25.27 J1.13
VSYNC  (via drill 0.51)
  Top 0.254: v45.21,77.98 45.21,43.18 53.98,34.42 58.04,34.42 59.69,32.77 J2.8 | 59.69,27.94 J1.8 J2.8 | J2.8 59.69,30.35
  Bottom 0.254: v45.21,77.98 32.26,90.93 32.26,92.71 S4.1

### Text on the board
tPlace: SYNC | HSYNC | VSYNC | IN | SMALL | 9V CENTER POSITIVE | IN | ALL | IN | ALL | IN | ALL | BIG | IN | 2N2222 | OUT | OUT | OUT | GND | GND | MODE | RATE | HSYNC | HSYNC | SYNC | SYNC | VCC | VCC | RGBNDR: VGA CIRCUIT BENDER MODULE REV 3 - OTSOS.NET 2019
tNames: - | + | R | B | VSYNC | MODE2 | RATE2 | GND | VCC | G | HSYNC | MODE1 | RATE1 | GND | GND
bNames: R | B | VSYNC | MODE2 | RATE2 | GND | VCC | G | HSYNC | MODE1 | RATE1 | GND | GND